# Altium project PR003.PrjPcb (part 11 of 11)

## Sheet CAM_Connector.SchDoc
size A3; SheetNumber: 10; SheetTotal: 16
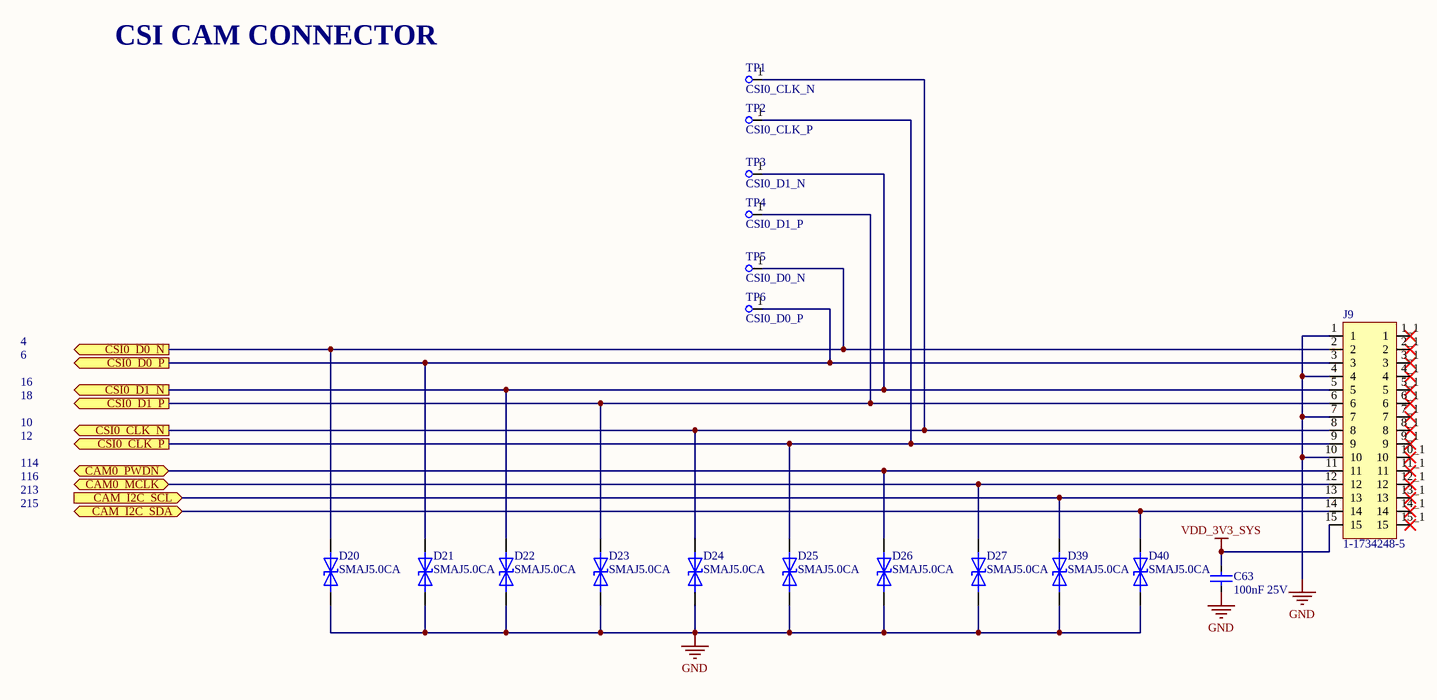
[diagram p16: CAM_Connector.SchDoc]

### Parts
C63  100nF 25V  [C0402]
D20  SMAJ5.0CA  [DO-214AC]
D21  SMAJ5.0CA  [DO-214AC]
D22  SMAJ5.0CA  [DO-214AC]
D23  SMAJ5.0CA  [DO-214AC]
D24  SMAJ5.0CA  [DO-214AC]
D25  SMAJ5.0CA  [DO-214AC]
D26  SMAJ5.0CA  [DO-214AC]
D27  SMAJ5.0CA  [DO-214AC]
D39  SMAJ5.0CA  [DO-214AC]
D40  SMAJ5.0CA  [DO-214AC]
J9  1-1734248-5  [1-1734248-5]
TP1  CSI0_CLK_N  [TestPoint_Pad_D1.0mm]
TP2  CSI0_CLK_P  [TestPoint_Pad_D1.0mm]
TP3  CSI0_D1_N  [TestPoint_Pad_D1.0mm]
TP4  CSI0_D1_P  [TestPoint_Pad_D1.0mm]
TP5  CSI0_D0_N  [TestPoint_Pad_D1.0mm]
TP6  CSI0_D0_P  [TestPoint_Pad_D1.0mm]

### Ports
CAM0_MCLK (bidir), CAM0_PWDN (bidir), CAM_I2C_SCL (in), CAM_I2C_SDA (bidir), CSI0_CLK_N (out), CSI0_CLK_P (out), CSI0_D0_N (out), CSI0_D0_P (out), CSI0_D1_N (out), CSI0_D1_P (out)

### Nets
GND: C63.1 D20.C D21.C D22.C D23.C D24.C D25.C D26.C D27.C D39.C D40.C J9.1 J9.4 J9.7 J9.10
VDD_3V3_SYS: C63.2 J9.15
CAM_I2C_SCL: D39.A J9.13 ; port CAM_I2C_SCL
CAM_I2C_SDA: D40.A J9.14 ; port CAM_I2C_SDA
NetD20_A: D20.A J9.2 TP5.1 ; port CSI0_D0_N
NetD21_A: D21.A J9.3 TP6.1 ; port CSI0_D0_P
NetD22_A: D22.A J9.5 TP3.1 ; port CSI0_D1_N
NetD23_A: D23.A J9.6 TP4.1 ; port CSI0_D1_P
NetD24_A: D24.A J9.8 TP1.1 ; port CSI0_CLK_N
NetD25_A: D25.A J9.9 TP2.1 ; port CSI0_CLK_P
NetD26_A: D26.A J9.11 ; port CAM0_PWDN
NetD27_A: D27.A J9.12 ; port CAM0_MCLK

Not connected (* = marked no-connect by the designer): J9 1_1(1)* 2_1(2)* 3_1(3)* 4_1(4)* 5_1(5)* 6_1(6)* 7_1(7)* 8_1(8)* 9_1(9)* 10_1(10)* 11_1(11)* 12_1(12)* 13_1(13)* 14_1(14)* 15_1(15)*

### Notes on the sheet
- CSI CAM CONNECTOR
- 4
- 6
- 10
- 12
- 16
- 18
- 213
- 215
- 114
- 116

### Library data of the parts
C63 = TMK105BJ104KV-F: CAP CER 0.1UF 25V X5R 0402 / High Value Multilayer Ceramic Capacitors (High dielectric type); Manufacturer: Taiyo Yuden; Tolerance: 10%; Supplier 1: Digi-Key; Manufacturer Part Number: TMK105BJ104KV-F; RoHS: Yes; Category: Ceramic Capacitors; Stock 1: 11997960; Pricing 1: 1=0.10000, 10=0.03700, 50=0.02000, 100=0.01630, 500=0.01166, 1000=0.00917, 2500=0.00833, 5000=0.00767 (USD); Mount: Surface Mount; Case/Package: 0402; Number of Pins: 2; Case Code (Imperial): 0402; Case Code (Metric): 1005; Weight: 2.3E-05oz; Min Operating Temperature: -55°C; Max Operating Temperature: 85°C; Capacitance: 100nF; Packaging: Tape and Reel; Dielectric: X5R; Voltage Rating (DC): 25V; Voltage Rating: 25V; Package Quantity: 1; Termination: SMD/SMT; Resistor Type: Ceramic; Voltage: 25V; Series: M; Construction: Flat; Length: 1mm; Width: 0.02inch; Height: 0.5mm; Depth: 0.5mm; Thickness: 0.022inch; Reach SVHC Compliant: Yes; Lead Free: Lead Free; Halogen Free: Halogen Free; RoHS Compliant: Yes; Supplier Part Number 1: 587-1456-1-ND
D20-D27 D39 D40 = SMAJ5.0CA: Transient Voltage Suppressor, TVS, SMAJ Series, Bidirectional, 5 V, DO-214AC, 2, 6.4 V RoHS Compliant: Yes; Manufacturer: Littelfuse; Reverse Breakdown Voltage: 6.4V; Operating Supply Voltage: 5V; Max Surge Current: 43.5A; Number of Elements: 1; Clamping Voltage: 9.2V; Peak Pulse Power: 400W; Power Line Protection: No; Test Current: 10mA; Max Reverse Leakage Current: 800uA; Max Breakdown Voltage: 7V; Max Power Dissipation: 3.3W; Element Configuration: Single; Leakage Current: 1.6mA; Capacitance: 1.05nF; Diode Type: ZENER; Supplier 1: Digi-Key; Manufacturer Part Number: SMAJ5.0CA; RoHS: Yes; Category: TVS Diodes; Stock 1: 526420; Pricing 1: 1=0.43000, 10=0.32000, 100=0.19950, 500=0.13650, 1000=0.10500, 2000=0.09450 (USD); Mount: Surface Mount; Case/Package: DO-214AC; Number of Pins: 2; Min Operating Temperature: -65°C; Max Operating Temperature: 150°C; Package Quantity: 5000; Direction: Bidirectional; Packaging: Tape and Reel; Number of Bidirectional Channels: 1; Reverse Standoff Voltage: 5V; Min Breakdown Voltage: 6.4V; Breakdown Voltage: 6.4V; Number of Channels: 1; Polarity: Bidirectional; Termination: SMD/SMT; Peak Pulse Current: 43.5A; Power Dissipation: 400W; Voltage Rating (DC): 5V; Max Output Current: 43.5A; Resistor Type: Zener; Series: SMAJ; Clamping Voltage-Max: 9.2V; Length: 4.5mm; Width: 2.79mm; Height: 2.087mm; Radiation Hardening: No; Reach SVHC Compliant: Yes; Lead Free: Lead Free; RoHS Compliant: Yes; ComponentLink1URL: https://datasheet.ciiva.com/25624/0900766b810f4edb-25624837.pdf?src-supplier=Rs; ComponentLink1Description: https://datasheet.ciiva.com/25624/0900766b810f4edb-25624837.pdf?src-supplier=Rs; ComponentLink2URL: https://datasheet.ciiva.com/28473/607617-28473438.pdf?src-supplier=Element14; ComponentLink2Description: https://datasheet.ciiva.com/28473/607617-28473438.pdf?src-supplier=Element14; ComponentLink3URL: https://datasheet.ciiva.com/16206/littelfuse-tvs-diode-smaj-16206104.pdf?src-supplier=Future+Electronics; ComponentLink3Description: https://datasheet.ciiva.com/16206/littelfuse-tvs-diode-smaj-16206104.pdf?src-supplier=Future+Electronics; ComponentLink4URL: https://datasheet.ciiva.com/331/littelfuse-tvs-diode-smaj-datasheet-pdf-331055.pdf?src-supplier=Digi-Key; ComponentLink4Description: https://datasheet.ciiva.com/331/littelfuse-tvs-diode-smaj-datasheet-pdf-331055.pdf?src-supplier=Digi-Key; ComponentLink5URL: https://datasheet.ciiva.com/331/littelfuse-tvs-diode-smaj-datasheet-pdf-331056.pdf?src-supplier=Digi-Key; ComponentLink5Description: https://datasheet.ciiva.com/331/littelfuse-tvs-diode-smaj-datasheet-pdf-331056.pdf?src-supplier=Digi-Key; ComponentLink6URL: https://datasheet.ciiva.com/331/littelfuse-tvs-diode-smaj-datasheet-pdf-331054.pdf?src-supplier=Digi-Key; ComponentLink6Description: https://datasheet.ciiva.com/331/littelfuse-tvs-diode-smaj-datasheet-pdf-331054.pdf?src-supplier=Digi-Key; Supplier Part Number 1: SMAJ5.0CALFCT-ND
J9 = 1-1734248-5: FPC CONNECTOR, RECEPTACLE 15POS 1MMPITCH; Series: FPC; Gender: Receptacle; Pitch S; Manufacturer: TE Connectivity; Actuator Material: Nylon,Polyamide; Actuator Color: Black; Current Rating: 1A; Voltage Rating: 125V; Number of Positions: 15; Shielding: Unshielded; Connector Type: Receptacle,Connector,Socket; Wire/Cable Type: Flat Flex; Connector System: Flex-to-Board; Mating Alignment: Yes (With); PCB Mount Alignment: No (Without); PCB Mount Retention: With; Circuit Application: Signal; Pitch: 1mm; Supplier 1: Digi-Key; Manufacturer Part Number: 1-1734248-5; RoHS: Yes; Category: FFC / FPC; Stock 1: 68466; Pricing 1: 1=1.28000, 10=1.08100, 25=1.03680, 50=1.01460, 100=0.97050, 250=0.88224, 500=0.79402 (USD); Mount: Surface Mount; Contact Plating: Gold; Contact Material: Bronze; Housing Color: Black; Housing Material: Polyamide; Min Operating Temperature: -4°C; Max Operating Temperature: 185°C; Package Quantity: 1000; Packaging: Tape and Reel; Number of Rows: 1; Termination: SMD/SMT; Number of Contacts: 15; Orientation: Straight; Sealable: No (Without); Shrouded: Yes (With); Contact Current Rating: 1A; Length: 22.4mm; Width: 4.6mm; Height: 7.7mm; Depth: 4.6mm; ELV: Compliant; Flammability Rating: UL94 V-0; RoHS Compliant: Yes; ComponentLink3URL: https://datasheet.ciiva.com/672/eng-cd-1734248-e1-672178.pdf?src-supplier=Digi-Key; ComponentLink3Description: Datasheet; Supplier Part Number 1: A101418DKR-ND
TP1-TP6 = TestPoint_D1mm

## Nets that join several sheets
GND: TypeC_USB2.0 (39 pins), USB3.2_Type_A (20 pins), M.2_M_NVMe (21 pins), Ethernet (9 pins), HDMI_Connector (26 pins), Block_UART, I2C, CAN and GPIOs (77 pins), Audio_CodeC (17 pins), LevelShifters_GPIOs (41 pins), SoC_Fan_Header (8 pins), Config_UART_OptionalHeader (18 pins), Power_Circuit (46 pins), ON_OFF_Circuit (11 pins), CAM_Connector (15 pins)
VDD_1V8: M.2_M_NVMe (R138.2), HDMI_Connector (R56.2), Block_UART, I2C, CAN and GPIOs (R41.2 R42.2), Audio_CodeC (5 pins), LevelShifters_GPIOs (9 pins), SoC_Fan_Header (C65.2 Q2.1 R114.2 U18.6), Config_UART_OptionalHeader (9 pins), Power_Circuit (C9.2 U4.5)
VDD_3V3_SYS: Block_GPIOs, USB2.0, I2S, SPI, GBe and CSI (R43.2 R44.2), M.2_M_NVMe (17 pins), Ethernet (C31.2 J5.15 J5.17), HDMI_Connector (U15.5 U15.6), Block_UART, I2C, CAN and GPIOs (R39.2 R40.2 R168.2 R169.2), LevelShifters_GPIOs (9 pins), Config_UART_OptionalHeader (C69.2 R115.2 U23.8), Power_Circuit (9 pins), CAM_Connector (C63.2 J9.15)
VDD_5V_IN: USB3.2_Type_A (5 pins), HDMI_Connector (C33.2 C34.2 U13.5), Block_UART, I2C, CAN and GPIOs (15 pins), Audio_CodeC (R46.2), LevelShifters_GPIOs (C79.2 J12.2 J12.4), SoC_Fan_Header (5 pins), Config_UART_OptionalHeader (R140.1), Power_Circuit (19 pins), ON_OFF_Circuit (8 pins)
VDD_5V_USB: TypeC_USB2.0 (18 pins), Power_Circuit (10 pins)
3V3_IO_PG: Block_GPIOs, USB2.0, I2S, SPI, GBe and CSI (J10.218), Power_Circuit (R23.2 U4.3 U5.5)
CAM_I2C_SCL: Block_GPIOs, USB2.0, I2S, SPI, GBe and CSI (J10.213 R43.1), CAM_Connector (D39.A J9.13)
CAM_I2C_SDA: Block_GPIOs, USB2.0, I2S, SPI, GBe and CSI (J10.215 R44.1), CAM_Connector (D40.A J9.14)
FORCE_OFF*: Block_UART, I2C, CAN and GPIOs (J10.233), ON_OFF_Circuit (R151.1)
I2C0_SCL: Block_UART, I2C, CAN and GPIOs (J10.185 R39.1), LevelShifters_GPIOs (D32.A J12.28)
I2C0_SDA: Block_UART, I2C, CAN and GPIOs (J10.187 R40.1), LevelShifters_GPIOs (D33.A J12.27)
I2C1_SCL: Block_UART, I2C, CAN and GPIOs (J10.189 R41.1), LevelShifters_GPIOs (D34.A J12.5)
I2C1_SDA: Block_UART, I2C, CAN and GPIOs (J10.191 R42.1), LevelShifters_GPIOs (D35.A J12.3)
I2C2_SCL: M.2_M_NVMe (R189.2), Block_UART, I2C, CAN and GPIOs (J10.232 R169.1), Audio_CodeC (R133.1 TP35.1), Config_UART_OptionalHeader (TP9.1 U21.6)
I2C2_SDA: M.2_M_NVMe (R188.2), Block_UART, I2C, CAN and GPIOs (J10.234 R168.1), Audio_CodeC (R131.1 TP34.1), Config_UART_OptionalHeader (TP10.1 U21.5)
LATCH_SET: Config_UART_OptionalHeader (D29.2 J11.5), ON_OFF_Circuit (C.2 J3.2 R32.1 U7.1)
LATCH_SET_BUT: Config_UART_OptionalHeader (D28.2 J11.6), ON_OFF_Circuit (J3.1 R31.1 U6.4)
M2_M_ALERT: Block_GPIOs, USB2.0, I2S, SPI, GBe and CSI (J10.212), M.2_M_NVMe (J17.44 R138.1)
MOD_SLEEP*: HDMI_Connector (R63.2 U15.3), Block_UART, I2C, CAN and GPIOs (J10.178 R173.1), Config_UART_OptionalHeader (R121.1)
NetC42_1: Block_HDMI, DP, DSI, USBSS and PCIe (J10.81), HDMI_Connector (C42.1)
NetC44_1: Block_HDMI, DP, DSI, USBSS and PCIe (J10.83), HDMI_Connector (C44.1)
NetC45_1: Block_HDMI, DP, DSI, USBSS and PCIe (J10.75), HDMI_Connector (C45.1)
NetC46_1: Block_HDMI, DP, DSI, USBSS and PCIe (J10.77), HDMI_Connector (C46.1)
NetC47_1: Block_HDMI, DP, DSI, USBSS and PCIe (J10.69), HDMI_Connector (C47.1)
NetC48_1: Block_HDMI, DP, DSI, USBSS and PCIe (J10.71), HDMI_Connector (C48.1)
NetC49_1: Block_HDMI, DP, DSI, USBSS and PCIe (J10.63), HDMI_Connector (C49.1)
NetC50_1: Block_HDMI, DP, DSI, USBSS and PCIe (J10.65), HDMI_Connector (C50.1)
NetC135_2: Block_HDMI, DP, DSI, USBSS and PCIe (J10.136), M.2_M_NVMe (C135.2)
NetC136_2: Block_HDMI, DP, DSI, USBSS and PCIe (J10.134), M.2_M_NVMe (C136.2)
NetC137_2: Block_HDMI, DP, DSI, USBSS and PCIe (J10.142), M.2_M_NVMe (C137.2)
NetC138_2: Block_HDMI, DP, DSI, USBSS and PCIe (J10.140), M.2_M_NVMe (C138.2)
NetC139_2: Block_HDMI, DP, DSI, USBSS and PCIe (J10.150), M.2_M_NVMe (C139.2)
NetC140_2: Block_HDMI, DP, DSI, USBSS and PCIe (J10.148), M.2_M_NVMe (C140.2)
NetC141_2: Block_HDMI, DP, DSI, USBSS and PCIe (J10.156), M.2_M_NVMe (C141.2)
NetC142_2: Block_HDMI, DP, DSI, USBSS and PCIe (J10.154), M.2_M_NVMe (C142.2)
NetD14_1: Block_HDMI, DP, DSI, USBSS and PCIe (J10.94), HDMI_Connector (D14.1 Q4.2 R64.1)
NetD20_A: Block_GPIOs, USB2.0, I2S, SPI, GBe and CSI (J10.4), CAM_Connector (D20.A J9.2 TP5.1)
NetD21_A: Block_GPIOs, USB2.0, I2S, SPI, GBe and CSI (J10.6), CAM_Connector (D21.A J9.3 TP6.1)
NetD22_A: Block_GPIOs, USB2.0, I2S, SPI, GBe and CSI (J10.16), CAM_Connector (D22.A J9.5 TP3.1)
NetD23_A: Block_GPIOs, USB2.0, I2S, SPI, GBe and CSI (J10.18), CAM_Connector (D23.A J9.6 TP4.1)
NetD24_A: Block_GPIOs, USB2.0, I2S, SPI, GBe and CSI (J10.10), CAM_Connector (D24.A J9.8 TP1.1)
NetD25_A: Block_GPIOs, USB2.0, I2S, SPI, GBe and CSI (J10.12), CAM_Connector (D25.A J9.9 TP2.1)
NetD26_A: Block_GPIOs, USB2.0, I2S, SPI, GBe and CSI (J10.114), CAM_Connector (D26.A J9.11)
NetD27_A: Block_GPIOs, USB2.0, I2S, SPI, GBe and CSI (J10.116), CAM_Connector (D27.A J9.12)
NetD47_2: Block_UART, I2C, CAN and GPIOs (D47.2 J10.214), Config_UART_OptionalHeader (J11.10)
NetJ5_1: Block_GPIOs, USB2.0, I2S, SPI, GBe and CSI (J10.186), Ethernet (J5.1)
NetJ5_2: Block_GPIOs, USB2.0, I2S, SPI, GBe and CSI (J10.184), Ethernet (J5.2)
NetJ5_3: Block_GPIOs, USB2.0, I2S, SPI, GBe and CSI (J10.192), Ethernet (J5.3)
NetJ5_6: Block_GPIOs, USB2.0, I2S, SPI, GBe and CSI (J10.190), Ethernet (J5.6)
NetJ5_7: Block_GPIOs, USB2.0, I2S, SPI, GBe and CSI (J10.198), Ethernet (J5.7)
NetJ5_8: Block_GPIOs, USB2.0, I2S, SPI, GBe and CSI (J10.196), Ethernet (J5.8)
NetJ5_9: Block_GPIOs, USB2.0, I2S, SPI, GBe and CSI (J10.204), Ethernet (J5.9)
NetJ5_10: Block_GPIOs, USB2.0, I2S, SPI, GBe and CSI (J10.202), Ethernet (J5.10)
NetJ10_87: Block_GPIOs, USB2.0, I2S, SPI, GBe and CSI (J10.87), TypeC_USB2.0 (Q8.3)
NetJ10_89: Block_GPIOs, USB2.0, I2S, SPI, GBe and CSI (J10.89), LevelShifters_GPIOs (U24.4)
NetJ10_91: Block_GPIOs, USB2.0, I2S, SPI, GBe and CSI (J10.91), LevelShifters_GPIOs (U24.1)
NetJ10_93: Block_GPIOs, USB2.0, I2S, SPI, GBe and CSI (J10.93), LevelShifters_GPIOs (U24.3)
NetJ10_95: Block_GPIOs, USB2.0, I2S, SPI, GBe and CSI (J10.95), LevelShifters_GPIOs (U24.5)
NetJ10_96: Block_HDMI, DP, DSI, USBSS and PCIe (J10.96), HDMI_Connector (R56.1 U14.3)
NetJ10_97: Block_GPIOs, USB2.0, I2S, SPI, GBe and CSI (J10.97), LevelShifters_GPIOs (U24.6)
NetJ10_98: Block_HDMI, DP, DSI, USBSS and PCIe (J10.98), HDMI_Connector (R60.1 U16.4)
NetJ10_100: Block_HDMI, DP, DSI, USBSS and PCIe (J10.100), HDMI_Connector (R59.1 U16.1)
NetJ10_104: Block_GPIOs, USB2.0, I2S, SPI, GBe and CSI (J10.104), LevelShifters_GPIOs (U25.4)
NetJ10_106: Block_GPIOs, USB2.0, I2S, SPI, GBe and CSI (J10.106), LevelShifters_GPIOs (U25.1)
NetJ10_108: Block_GPIOs, USB2.0, I2S, SPI, GBe and CSI (J10.108), LevelShifters_GPIOs (U25.3)
NetJ10_110: Block_GPIOs, USB2.0, I2S, SPI, GBe and CSI (J10.110), LevelShifters_GPIOs (U25.5)
NetJ10_112: Block_GPIOs, USB2.0, I2S, SPI, GBe and CSI (J10.112), LevelShifters_GPIOs (U25.6)
NetJ10_118: Block_GPIOs, USB2.0, I2S, SPI, GBe and CSI (J10.118), LevelShifters_GPIOs (U24.7)
NetJ10_124: Block_GPIOs, USB2.0, I2S, SPI, GBe and CSI (J10.124), LevelShifters_GPIOs (U24.8)
NetJ10_128: Block_GPIOs, USB2.0, I2S, SPI, GBe and CSI (J10.128), TypeC_USB2.0 (Q12.3)
NetJ10_130: Block_GPIOs, USB2.0, I2S, SPI, GBe and CSI (J10.130), TypeC_USB2.0 (Q13.3)
NetJ10_131: Block_HDMI, DP, DSI, USBSS and PCIe (J10.131), M.2_M_NVMe (J17.41)
NetJ10_133: Block_HDMI, DP, DSI, USBSS and PCIe (J10.133), M.2_M_NVMe (J17.43)
NetJ10_137: Block_HDMI, DP, DSI, USBSS and PCIe (J10.137), M.2_M_NVMe (J17.29)
NetJ10_139: Block_HDMI, DP, DSI, USBSS and PCIe (J10.139), M.2_M_NVMe (J17.31)
NetJ10_143: Block_UART, I2C, CAN and GPIOs (J10.143), LevelShifters_GPIOs (J12.31)
NetJ10_145: Block_UART, I2C, CAN and GPIOs (J10.145), LevelShifters_GPIOs (J12.29)
NetJ10_149: Block_HDMI, DP, DSI, USBSS and PCIe (J10.149), M.2_M_NVMe (J17.17)
NetJ10_151: Block_HDMI, DP, DSI, USBSS and PCIe (J10.151), M.2_M_NVMe (J17.19)
NetJ10_155: Block_HDMI, DP, DSI, USBSS and PCIe (J10.155), M.2_M_NVMe (J17.5)
NetJ10_157: Block_HDMI, DP, DSI, USBSS and PCIe (J10.157), M.2_M_NVMe (J17.7)
NetJ10_160: Block_HDMI, DP, DSI, USBSS and PCIe (J10.160), M.2_M_NVMe (J17.53)
NetJ10_162: Block_HDMI, DP, DSI, USBSS and PCIe (J10.162), M.2_M_NVMe (J17.55)
NetJ10_179: Block_HDMI, DP, DSI, USBSS and PCIe (J10.179), M.2_M_NVMe (R187.2)
NetJ10_180: Block_HDMI, DP, DSI, USBSS and PCIe (J10.180), M.2_M_NVMe (J17.52 R185.1)
NetJ10_181: Block_HDMI, DP, DSI, USBSS and PCIe (J10.181), M.2_M_NVMe (J17.50 R139.1)
NetJ10_188: Block_GPIOs, USB2.0, I2S, SPI, GBe and CSI (J10.188), Ethernet (R54.1)
NetJ10_193: Block_GPIOs, USB2.0, I2S, SPI, GBe and CSI (J10.193), LevelShifters_GPIOs (U26.3)
NetJ10_194: Block_GPIOs, USB2.0, I2S, SPI, GBe and CSI (J10.194), Ethernet (R55.1)
NetJ10_195: Block_GPIOs, USB2.0, I2S, SPI, GBe and CSI (J10.195), LevelShifters_GPIOs (U26.4)
NetJ10_197: Block_GPIOs, USB2.0, I2S, SPI, GBe and CSI (J10.197), LevelShifters_GPIOs (U26.5)
NetJ10_199: Block_GPIOs, USB2.0, I2S, SPI, GBe and CSI (J10.199), LevelShifters_GPIOs (U26.1)
NetJ10_203: Block_UART, I2C, CAN and GPIOs (J10.203), LevelShifters_GPIOs (U26.6)
NetJ10_205: Block_UART, I2C, CAN and GPIOs (J10.205), LevelShifters_GPIOs (U26.7)
NetJ10_206: Block_GPIOs, USB2.0, I2S, SPI, GBe and CSI (J10.206), LevelShifters_GPIOs (U25.7)
NetJ10_207: Block_UART, I2C, CAN and GPIOs (J10.207), LevelShifters_GPIOs (U26.8)
NetJ10_208: Block_GPIOs, USB2.0, I2S, SPI, GBe and CSI (J10.208), SoC_Fan_Header (Q2.2 R114.1)
NetJ10_209: Block_UART, I2C, CAN and GPIOs (J10.209), LevelShifters_GPIOs (U26.9)
NetJ10_211: Block_GPIOs, USB2.0, I2S, SPI, GBe and CSI (J10.211), Audio_CodeC (R94.1)
NetJ10_216: Block_GPIOs, USB2.0, I2S, SPI, GBe and CSI (J10.216), Audio_CodeC (R89.1)
NetJ10_220: Block_GPIOs, USB2.0, I2S, SPI, GBe and CSI (J10.220), Audio_CodeC (R97.1)
NetJ10_222: Block_GPIOs, USB2.0, I2S, SPI, GBe and CSI (J10.222), Audio_CodeC (R98.1)
NetJ10_224: Block_GPIOs, USB2.0, I2S, SPI, GBe and CSI (J10.224), Audio_CodeC (R96.1)
NetJ10_226: Block_GPIOs, USB2.0, I2S, SPI, GBe and CSI (J10.226), Audio_CodeC (R95.1)
NetJ10_228: Block_GPIOs, USB2.0, I2S, SPI, GBe and CSI (J10.228), LevelShifters_GPIOs (U24.9)
NetJ10_230: Block_GPIOs, USB2.0, I2S, SPI, GBe and CSI (J10.230), SoC_Fan_Header (R108.2 U18.4)
NetJ10_236: Block_UART, I2C, CAN and GPIOs (J10.236), Config_UART_OptionalHeader (U23.3)
NetJ10_238: Block_UART, I2C, CAN and GPIOs (J10.238), Config_UART_OptionalHeader (U23.2)
POWER_EN: Block_UART, I2C, CAN and GPIOs (J10.237), ON_OFF_Circuit (R30.2 U8.4)
PWR_BTN*: Block_UART, I2C, CAN and GPIOs (D48.2 J10.240 R170.1), Config_UART_OptionalHeader (J11.12), ON_OFF_Circuit (U6.2 U11.5)
PWR_LED_CTRL: Block_GPIOs, USB2.0, I2S, SPI, GBe and CSI (J10.127), Block_UART, I2C, CAN and GPIOs (R172.1), Config_UART_OptionalHeader (R120.1)
SYS_RST*: Block_UART, I2C, CAN and GPIOs (D46.2 J10.239), Config_UART_OptionalHeader (C71.2 J11.8), Power_Circuit (U5.11)
USB0_AP_N: Block_GPIOs, USB2.0, I2S, SPI, GBe and CSI (J10.109), TypeC_USB2.0 (D44.A J13.A7 J13.B7)
USB0_AP_P: Block_GPIOs, USB2.0, I2S, SPI, GBe and CSI (J10.111), TypeC_USB2.0 (D43.A J13.A6 J13.B6)
USB1_D_N: Block_GPIOs, USB2.0, I2S, SPI, GBe and CSI (J10.115), TypeC_USB2.0 (D51.A R154.1), USB3.2_Type_A (FL5.1 R182.1)
USB1_D_P: Block_GPIOs, USB2.0, I2S, SPI, GBe and CSI (J10.117), TypeC_USB2.0 (D50.A R153.1), USB3.2_Type_A (FL5.2 R183.1)
USB2_AP_N: Block_GPIOs, USB2.0, I2S, SPI, GBe and CSI (J10.121), TypeC_USB2.0 (D54.A J15.A7 J15.B7)
USB2_AP_P: Block_GPIOs, USB2.0, I2S, SPI, GBe and CSI (J10.123), TypeC_USB2.0 (D53.A J15.A6 J15.B6)
USB_TYPEA_FLT: Block_GPIOs, USB2.0, I2S, SPI, GBe and CSI (J10.126), USB3.2_Type_A (U19.6)
USBSS0_B_TX_N: Block_HDMI, DP, DSI, USBSS and PCIe (C124.2), USB3.2_Type_A (D56.1 J16.8)
USBSS0_B_TX_P: Block_HDMI, DP, DSI, USBSS and PCIe (C123.2), USB3.2_Type_A (D56.2 J16.9)
USBSS0_RX_N: Block_HDMI, DP, DSI, USBSS and PCIe (J10.161), USB3.2_Type_A (D55.4 J16.5)
USBSS0_RX_P: Block_HDMI, DP, DSI, USBSS and PCIe (J10.163), USB3.2_Type_A (D55.5 J16.6)